# Altium schematic sheet 03_SYS_POWER.SchDoc
size A4; SheetNumber: 4; SheetTotal: 11
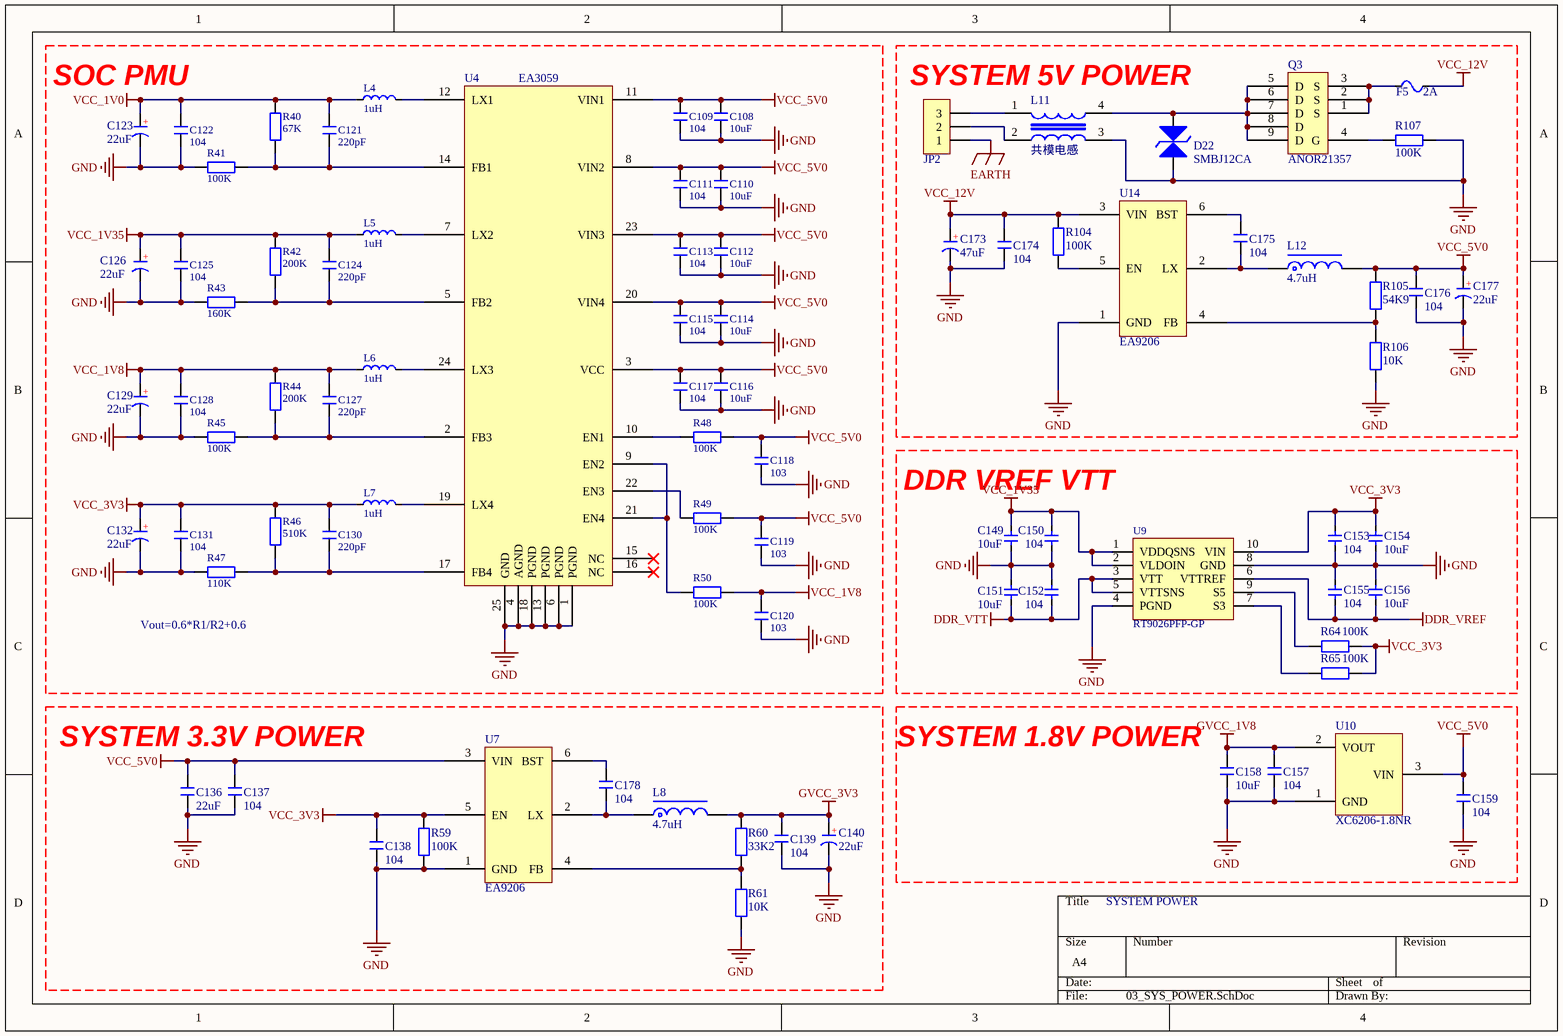
[diagram p0: 03_SYS_POWER.SchDoc]

## Parts
C108  10uF  [C 0805]
C109  104  [C 0603]
C110  10uF  [C 0805]
C111  104  [C 0603]
C112  10uF  [C 0805]
C113  104  [C 0603]
C114  10uF  [C 0805]
C115  104  [C 0603]
C116  10uF  [C 0805]
C117  104  [C 0603]
C118  103  [C 0603]
C119  103  [C 0603]
C120  103  [C 0603]
C121  220pF  [C 0603]
C122  104  [C 0603]
C123  22uF  [CD A(3216)]
C124  220pF  [C 0603]
C125  104  [C 0603]
C126  22uF  [CD A(3216)]
C127  220pF  [C 0603]
C128  104  [C 0603]
C129  22uF  [CD A(3216)]
C130  220pF  [C 0603]
C131  104  [C 0603]
C132  22uF  [CD A(3216)]
C136  22uF  [C 0805]
C137  104  [C 0603]
C138  104  [C 0603]
C139  104  [C 0603]
C140  22uF  [CD A(3216)]
C149  10uF  [C 0603]
C150  104  [C 0603]
C151  10uF  [C 0603]
C152  104  [C 0603]
C153  104  [C 0603]
C154  10uF  [C 0603]
C155  104  [C 0603]
C156  10uF  [C 0603]
C157  104  [C 0603]
C158  10uF  [C 0603]
C159  104  [C 0603]
C173  47uF  [CM C(5*5.4)]
C174  104  [C 0603]
C175  104  [C 0603]
C176  104  [C 0603]
C177  22uF  [CD A(3216)]
C178  104  [C 0603]
D22  SMBJ12CA  [SMB]
F5  2A  [PLCC-1812]
JP2  HDR-1X3  [KF2EDGE_3.81_3P]  (value not drawn)
L4  1uH  [L_2520]
L5  1uH  [L_2520]
L6  1uH  [L_2520]
L7  1uH  [L_2520]
L8  4.7uH  [L-SMD-0420]
L11  共模电感  [ACM7060]
L12  4.7uH  [L-SMD-0420]
Q3  ANOR21357  [DFN-8]
R40  67K  [R 0603]
R41  100K  [R 0603]
R42  200K  [R 0603]
R43  160K  [R 0603]
R44  200K  [R 0603]
R45  100K  [R 0603]
R46  510K  [R 0603]
R47  110K  [R 0603]
R48  100K  [R 0603]
R49  100K  [R 0603]
R50  100K  [R 0603]
R59  100K  [R 0603]
R60  33K2  [R 0603]
R61  10K  [R 0603]
R64  100K  [R 0603]
R65  100K  [R 0603]
R104  100K  [R 0603]
R105  54K9  [R 0603]
R106  10K  [R 0603]
R107  100K  [R 0603]
U4  EA3059  [QFN-24 14x14]
U7  EA9206  [SOT23-6L]
U9  RT9026PFP-GP  [MSOP10_PAD]
U10  XC6206-1.8NR  [SOT23-3M]
U14  EA9206  [SOT23-6L]

## Nets
DDR_VREF: C155.1 C156.1 U9.6(VTTREF)
DDR_VTT: C151.1 C152.1 U9.3(VTT) U9.5(VTTSNS)
EARTH: JP2.1
GND: C108.1 C109.1 C110.1 C111.1 C112.1 C113.1 C114.1 C115.1 C116.1 C117.1 C118.2 C119.1 C120.1 C122.1 C123.2(K) C125.1 C126.2(K) C128.1 C129.2(K) C131.1 C132.2(K) C136.1 C137.1 C138.1 C139.1 C140.2(K) C149.1 C150.1 C151.2 C152.2 C153.1 C154.1 C155.2 C156.2 C157.1 C158.1 C159.1 C173.2(K) C174.1 C176.1 C177.2(K) D22.1(A) L11.3 R41.2 R43.2 R45.2 R47.2 R59.2 R61.1 R106.1 R107.1 U4.1(PGND) U4.4(AGND) U4.6(PGND) U4.13(PGND) U4.18(PGND) U4.25(GND) U7.1(GND) U9.4(PGND) U9.8(GND) U9.11(PAD) U10.1(GND) U14.1(GND)
GVCC_1V8: C157.2 C158.2 U10.2(VOUT)
GVCC_3V3: C139.2 C140.1(A) L8.2 R60.2
VCC_1V0: C121.2 C122.2 C123.1(A) L4.1 R40.2
VCC_1V8: C120.2 C127.2 C128.2 C129.1(A) L6.1 R44.2 R50.2
VCC_1V35: C124.2 C125.2 C126.1(A) C149.2 C150.2 L5.1 R42.2 U9.1(VDDQSNS) U9.2(VLDOIN)
VCC_3V3: C130.2 C131.2 C132.1(A) C138.2 C153.2 C154.2 L7.1 R46.2 R59.1 R64.2 R65.2 U7.5(EN) U9.10(VIN)
VCC_5V0: C108.2 C109.2 C110.2 C111.2 C112.2 C113.2 C114.2 C115.2 C116.2 C117.2 C118.1 C119.2 C136.2 C137.2 C159.2 C176.2 C177.1(A) L12.2 R48.2 R49.2 R105.2 U4.3(VCC) U4.8(VIN2) U4.11(VIN1) U4.20(VIN4) U4.23(VIN3) U7.3(VIN) U10.3(VIN)
VCC_12V: C173.1(A) C174.2 F5.2 R104.2 U14.3(VIN)
NetC121_1: C121.1 R40.1 R41.1 U4.14(FB1)
NetC124_1: C124.1 R42.1 R43.1 U4.5(FB2)
NetC127_1: C127.1 R44.1 R45.1 U4.2(FB3)
NetC130_1: C130.1 R46.1 R47.1 U4.17(FB4)
NetC175_1: C175.1 L12.1 U14.2(LX)
NetC175_2: C175.2 U14.6(BST)
NetC178_1: C178.1 L8.1 U7.2(LX)
NetC178_2: C178.2 U7.6(BST)
NetD22_2: D22.2(K) L11.4 Q3.5(D) Q3.6(D) Q3.7(D) Q3.8(D) Q3.9(D)
NetF5_1: F5.1 Q3.1(S) Q3.2(S) Q3.3(S)
NetJP2_2: JP2.2 L11.2
NetJP2_3: JP2.3 L11.1
NetL4_2: L4.2 U4.12(LX1)
NetL5_2: L5.2 U4.7(LX2)
NetL6_2: L6.2 U4.24(LX3)
NetL7_2: L7.2 U4.19(LX4)
NetQ3_4: Q3.4(G) R107.2
NetR48_1: R48.1 U4.10(EN1)
NetR49_1: R49.1 U4.22(EN3)
NetR50_1: R50.1 U4.9(EN2) U4.21(EN4)
NetR60_1: R60.1 R61.2 U7.4(FB)
NetR64_1: R64.1 U9.9(S5)
NetR65_1: R65.1 U9.7(S3)
NetR104_1: R104.1 U14.5(EN)
NetR105_1: R105.1 R106.2 U14.4(FB)

Not connected (* = marked no-connect by the designer): U4 15(NC)* 16(NC)*

## Notes on the sheet
- SOC PMU
- SYSTEM 5V POWER
- DDR VREF VTT
- (near R47) Vout=0.6*R1/R2+0.6
- SYSTEM 3.3V POWER
- SYSTEM 1.8V POWER
- SYSTEM POWER
- (in symbol C-CM) +

## Library data of the parts
C108-C122 C124 C125 C127 C128 C130 C131 C136-C139 C157-C159 C174-C176 C178 = C: 无极性贴片电容; 版权归属: 源创客; BOM名称: 无极性贴片电容; 学习资源: www.ooocke.com
C123 C126 C129 C132 C140 C173 C177 = C-CM: 贴片电解电容; 版权归属: 源创客; BOM名称: 贴片电解电容; 学习资源: www.ooocke.com
C149-C156 = 电容-0402: Capacitor; Value: 0.1u
D22 = TVS
F5 = FU: 贴片保险丝; 版权归属: 源创客; BOM名称: 贴片保险丝; 学习资源: www.ooocke.com
JP2 = Header 3: 3P接插件; 版权归属: 源创客; BOM名称: 3P接插件; 学习资源: www.ooocke.com
L4-L7 = L: 小功率贴片电感磁珠; 版权归属: 源创客; BOM名称: 小功率贴片电感; 学习资源: www.ooocke.com
L8 L12 = L-CDRH: 功率屏蔽电感; 版权归属: 源创客; BOM名称: 功率屏蔽电感; 学习资源: www.ooocke.com
Q3 = AONR21357
R40-R50 R59-R61 R64 R65 R104-R107 = R: 贴片电阻; 版权归属: 源创客; BOM名称: 贴片电阻; 学习资源: www.ooocke.com
U7 U14 = EA9206: DC-DC 3A输出
U9 = LDO RT9026: DDR 终端稳压器